# EAGLE design Pulsera (EAGLE 9.5.1)
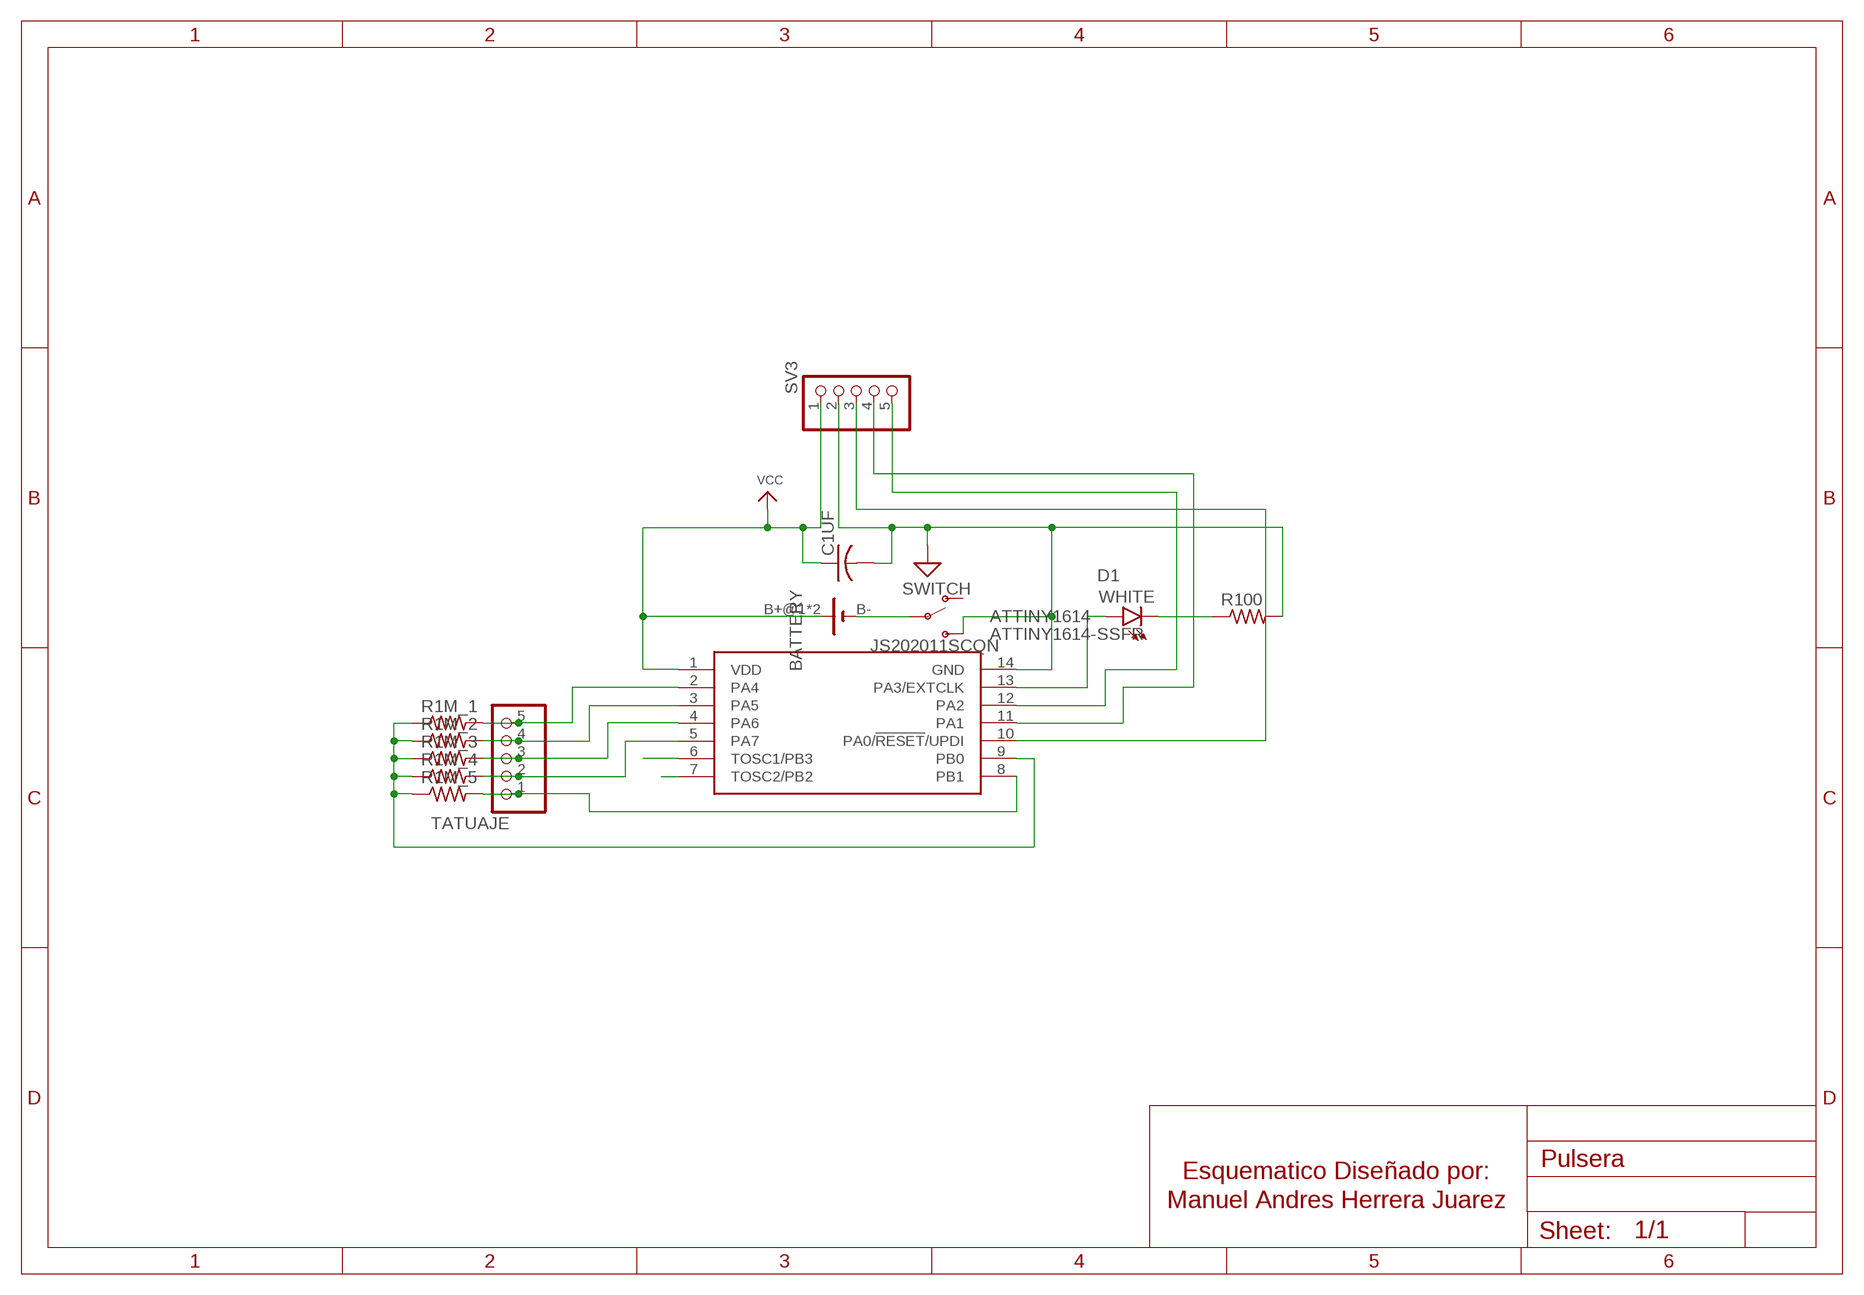
[diagram p0: schematic, sheet 1]

## Parts
ATTINY1614  ATTINY1614-SSFR  [SOIC127P600X175-14N]
BATTERY  BAT_HLD_CR12  [CR12-HOLDER]
C1UF  C-USC1206  [C1206]
D1  WHITE  LED-WHITE1206  [LED-1206]
R1M_1  R-US_R1206  [R1206]
R1M_2  R-US_R1206  [R1206]
R1M_3  R-US_R1206  [R1206]
R1M_4  R-US_R1206  [R1206]
R1M_5  R-US_R1206  [R1206]
R100  R-US_R1206  [R1206]
SV3  PINHD-1X5  [1X05]
SWITCH  JS202011SCQN  [JS202011SCQN]
TATUAJE  PINHD-1X5  [1X05]

## Nets
GND: ATTINY1614.14(GND) C1UF.2 R100.2 SV3.2 SWITCH.B2 SWITCH.L2 ; supply symbol labelled SUP
N$1: D1.C R100.1
N$2: ATTINY1614.6(TOSC1/PB3)
N$3: ATTINY1614.10(PA0/!RESET!/UPDI) SV3.3
N$4: ATTINY1614.9(PB0) R1M_1.1 R1M_2.1 R1M_3.1 R1M_4.1 R1M_5.1
N$5: ATTINY1614.11(PA1) SV3.4
N$6: ATTINY1614.7(TOSC2/PB2)
N$7: ATTINY1614.5(PA7) R1M_4.2 TATUAJE.2
N$8: ATTINY1614.8(PB1) R1M_5.2 TATUAJE.1
N$9: ATTINY1614.4(PA6) R1M_3.2 TATUAJE.3
N$10: ATTINY1614.3(PA5) R1M_2.2 TATUAJE.4
N$11: ATTINY1614.2(PA4) R1M_1.2 TATUAJE.5
N$12: ATTINY1614.12(PA2) SV3.5
N$13: ATTINY1614.13(PA3/EXTCLK) D1.A
N$14: BATTERY.B-(-) SWITCH.BC(C) SWITCH.LC(C)
VCC: ATTINY1614.1(VDD) BATTERY.B+@1(+) BATTERY.B+@2(+) C1UF.1 SV3.1
Unconnected: SWITCH.B1 SWITCH.L1

## Notes on the sheet
- Esquematico Diseñado por:
  Manuel Andres Herrera Juarez

## Library data of the parts
ATTINY1614 = SamacSys_Parts:ATTINY1614-SSFR: 8-bit Microcontrollers - MCU 20MHZ SOIC HIGH GRAD E 125C GRN Source: Datasheet <https://componentsearchengine.com/Datasheets/1/ATTINY1614-SSFR.pdf>; DESCRIPTION: 8-bit Microcontrollers - MCU 20MHZ SOIC HIGH GRAD E 125C GRN; HEIGHT: 1.75mm; MANUFACTURER_NAME: Microchip; MANUFACTURER_PART_NUMBER: ATTINY1614-SSFR; MOUSER_PART_NUMBER: 556-ATTINY1614SSFR; MOUSER_PRICE-STOCK: https://www.mouser.com/Search/Refine.aspx?Keyword=556-ATTINY1614SSFR
BATTERY = MyLibrary:BAT_HLD_CR12
C1UF = resistor:C-US: CAPACITOR, American symbol
D1 = SparkFun-LED:LED-WHITE: White SMD LED Used in manufacturing several products at SparkFun. Packages: 0603 - Bright White SMD 0603 package[Product Link] <http://www.kingbrightusa.com/product.asp?catalog_name=LED&product_id=APT1608QWF/D> 1206 - Bright White SMD1206 package [Product Link] <http://www.kingbrightusa.com/product.asp?catalog_name=LED&product_id=APT3216QWF/D> 3014 - Super Bright SMD 3014 package [Datasheet] <http://www.lumileds.com/uploads/459/DS208-pdf> SparkFun Products: Blackberry Trackballer Breakout <https://www.sparkfun.com/products/13169> Digital SandBox <https://www.sparkfun.com/products/12651>; PROD_ID: DIO-09955
R1M_1-R1M_5 R100 = resistor:R-US_: RESISTOR, American symbol
SV3 TATUAJE = pinhead:PINHD-1X5: PIN HEADER
SWITCH = MyLibrary:JS202011SCQN

## Board
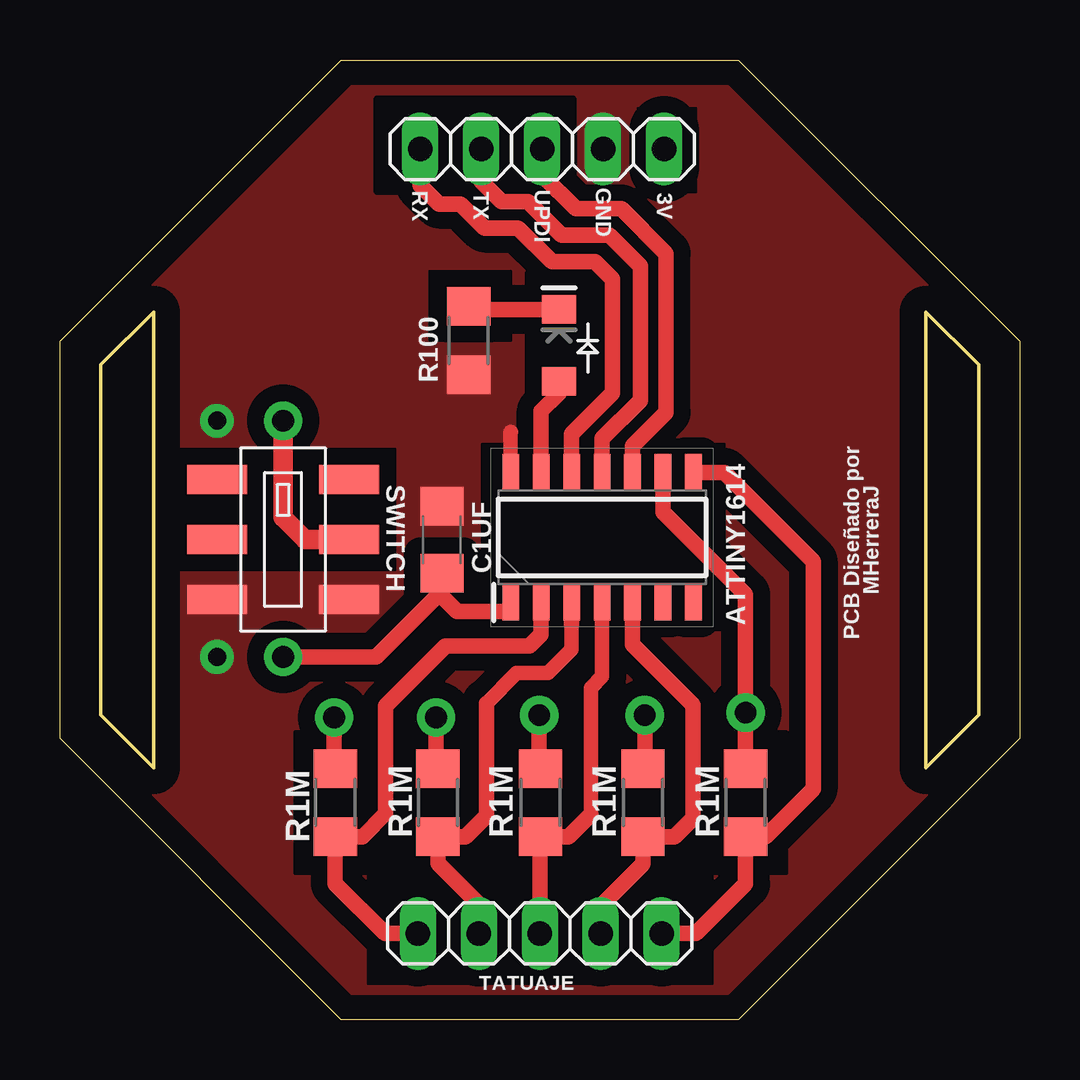
[diagram p1: board, top side]
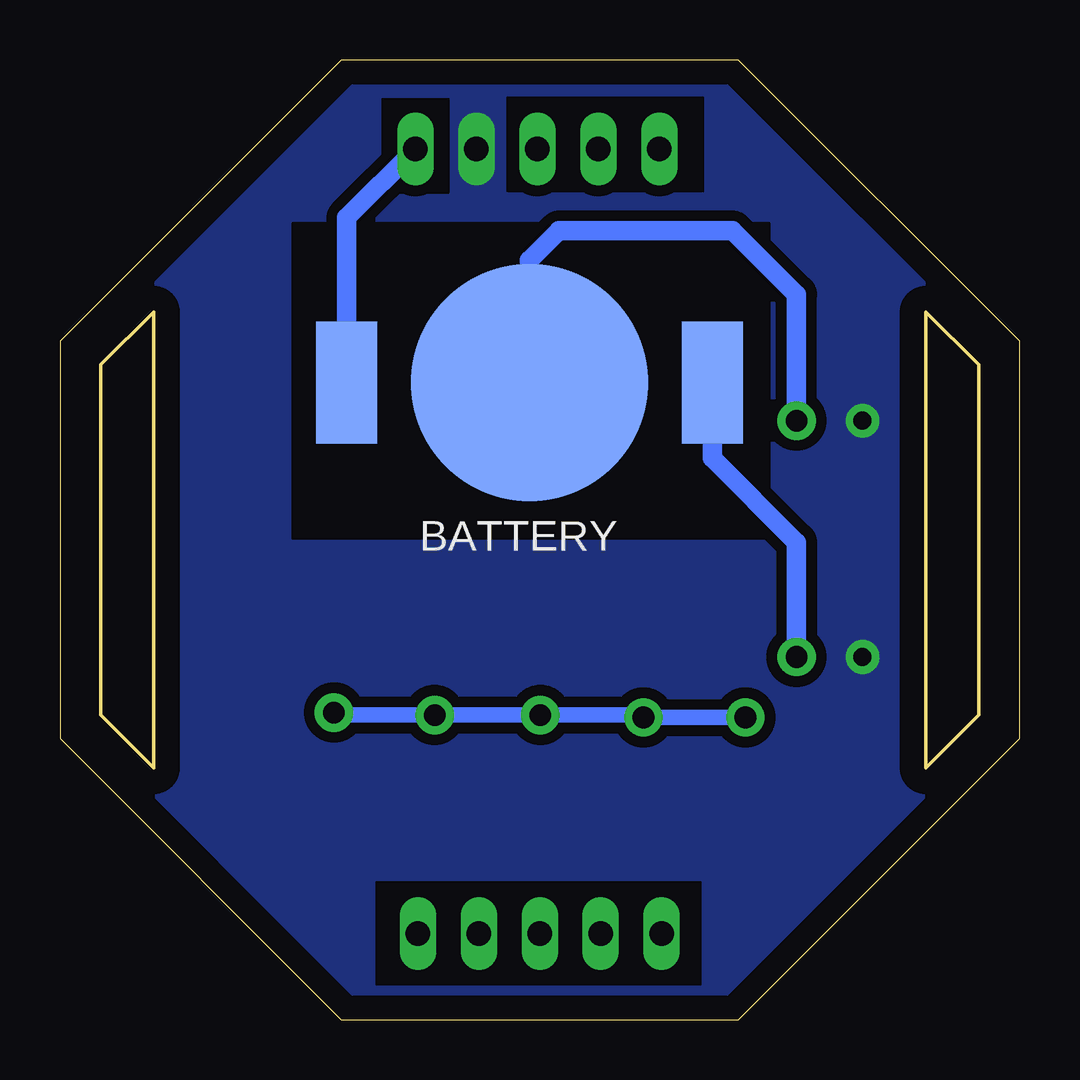
[diagram p2: board, bottom side, seen from below]

Size 40 x 40 mm. Coordinates in mm from the lower left corner, seen from the top.
Outline: 40,28.28 40,11.72 28.28,0 11.72,0 0,11.72 0,28.28 11.72,40 28.28,40 40,28.28
Copper layers (1*16): Top 0.035mm / dielectric 1.5mm / Bottom 0.035mm
Design rules "default": minimum track width 6mil, minimum drill 0.35mm, track to track 6mil, track to pad 6mil, pad to pad 6mil, via to via 6mil, smd to smd 6mil, copper to edge 40mil, drill to drill 6mil, minimum pad ring 10mil, minimum via ring 8mil, stop-mask expansion 4mil, vias tented up to drill 0mil, thermal gap 10mil

### Footprints (pad centres in the part's own frame; a part is rotated, then mirrored left to right if it is on the bottom)
SOIC127P600X175-14N = smd 1.525 x 0.7: 1 -2.712,3.81; 2 -2.712,2.54; 3 -2.712,1.27; 4 -2.712,0; 5 -2.712,-1.27; 6 -2.712,-2.54; 7 -2.712,-3.81; 8 2.712,-3.81; 9 2.712,-2.54; 10 2.712,-1.27; 11 2.712,0; 12 2.712,1.27; 13 2.712,2.54; 14 2.712,3.81
CR12-HOLDER = smd 2.54 x 5.08: B+@1 -7.62,0; B+@2 7.62,0 | smd 9.906 x 9.906: B- 0,0
C1206 = smd 1.6 x 1.8: 1 -1.4,0; 2 1.4,0
LED-1206 = smd 1.2 x 1.4: A -1.5,0; C 1.5,0
R1206 = smd 1.6 x 1.803: 1 -1.422,0; 2 1.422,0
1X05 = drill 1.016 long: 1 -5.08,0; 2 -2.54,0; 3 0,0; 4 2.54,0; 5 5.08,0
JS202011SCQN = smd 1.194 x 2.502: B1 -2.502,2.75; B2 2.502,2.75; BC 0,2.75; L1 -2.502,-2.75; L2 2.502,-2.75; LC 0,-2.75

### Placement (x,y rotation side)
ATTINY1614  22.6,20.1 90 top
BATTERY  20.43,26.55 180 bottom
C1UF  15.92,20 90 top
D1  20.8,28.1 90 top
R1M_1  11.48,9.04 270 top
R1M_2  15.75,9.04 270 top
R1M_3  20.03,9.04 270 top
R1M_4  24.3,9.04 270 top
R1M_5  28.58,9.04 270 top
R100  17.04,28.3 270 top
SV3  20.1,36.29 180 top
SWITCH  9.3,20.01 270 top
TATUAJE  20,3.59 180 top

### Tracks (layer width: path | path; a pad name or v marks a point on that pad's centre or on a via)
GND  (via drill 0.75 pad 1.4)
  Top 0.61: ATTINY1614.14 18.79,24.49 18.8,24.5
  other vias: 6.55,24.97 6.55,15.12
  pour Bottom (isolate 0.45, no thermals): 40,28.25 40,11.75 28.25,0 11.75,0 0,11.75 0,28.25 11.75,40 28.25,40
  pour Top (isolate 0.7, no thermals): 10.59,40 28.3,40 40,28.3 40,11.8 28.2,0 11.8,0 0,11.8 0,29.41
N$1
  Top 0.65: D1.C 17.16,29.6 R100.1
N$3
  Top 0.65: ATTINY1614.10 23.87,23.91 25.27,25.31 25.27,31.93 23.4,33.8 21.5,33.8 20.1,35.2 SV3.3
N$4  (via drill 0.9 pad 1.6)
  Top 0.65: R1M_5.1 v28.58,12.79 28.58,17.72 25.14,21.16 ATTINY1614.9 | v24.38,12.69 24.38,10.54 R1M_4.1 | R1M_3.1 19.98,10.52 v19.98,12.69 | R1M_2.1 15.68,10.54 v15.68,12.59 | v11.43,12.59 11.43,10.52 R1M_1.1
  Bottom 0.65: v28.58,12.79 28.48,12.69 v24.38,12.69 v19.98,12.69 15.78,12.69 v15.68,12.59 v11.43,12.59
N$5
  Top 0.65: ATTINY1614.11 22.6,24.21 24.2,25.81 24.2,31.4 22.9,32.7 20.9,32.7 19.5,34.1 18.4,34.1 17.56,34.94 SV3.4
N$7
  Top 0.65: ATTINY1614.5 23.87,15.63 26.38,13.12 26.38,8.39 25.61,7.62 R1M_4.2 24.3,6.48 22.54,4.72 TATUAJE.2
N$8
  Top 0.65: ATTINY1614.8 27.69,22.81 31.4,19.1 31.4,9.62 29.41,7.62 R1M_5.2 28.58,5.65 26.52,3.59 TATUAJE.1
N$9
  Top 0.61: ATTINY1614.4 22.6,14.3 22.13,13.83 22.13,8.54
  Top 0.65: 22.13,8.54 21.21,7.62 R1M_3.2 20,7.59 TATUAJE.3
N$10
  Top 0.61: 17.78,13.18 19.04,14.44 20.34,14.44 21.33,15.43 21.33,16.43
  Top 0.65: 21.33,16.43 ATTINY1614.3 | 17.78,13.18 17.78,8.49 16.91,7.62 R1M_2.2 15.75,6.51 17.46,4.81 TATUAJE.4
N$11
  Top 0.65: 11.48,7.2 R1M_1.2 | R1M_1.2 12.61,7.62 13.58,8.59 13.58,13.08 16.06,15.56 19.56,15.56 20.06,16.06 ATTINY1614.2 | R1M_1.2 11.48,5.67 13.55,3.59 TATUAJE.5
N$12
  Top 0.65: ATTINY1614.12 21.33,24.41 23.03,26.11 23.03,30.87 22.3,31.6 20.5,31.6 19.1,33 17.7,33 16.7,34 15.8,34 15.02,34.78 SV3.5
N$13
  Top 0.65: ATTINY1614.13 20.06,25.36 20.8,26.1 D1.A
N$14  (via drill 0.9 pad 1.6)
  Top 0.813: v9.3,24.97 9.3,20.92 10.21,20.01 SWITCH.BC
  Bottom 0.75: BATTERY.B- 18.84,24.97
  Bottom 0.813: v9.3,24.97 9.3,30.22 11.96,32.88 19.2,32.88 20.43,31.65 BATTERY.B-
NC
  cutout Top: 17.6,16.25 17.6,24 27.7,24 27.7,16.25
  cutout Bottom: 10.43,20.06 30.3,20.06 30.3,33.19 10.43,33.19
  cutout Top: 18.8,28.3 15.4,28.3 15.4,31.2 18.8,31.2
  cutout Bottom: 13.3,5.72 26.8,5.72 26.8,1.48 13.3,1.48
  cutout Bottom: 26.55,38.38 23.8,38.38 23.8,34.48 26.55,34.48
  cutout Bottom: 21.35,38.42 13.2,38.42 13.2,34.52 21.35,34.52
  cutout Top: 14.78,17.1 17.1,17.1 17.1,19.8 14.78,19.8
  cutout Top: 19.44,31.13 22.11,31.13 22.11,25.58 19.44,25.58
  cutout Top: 13.2,38.4 21.4,38.4 21.4,34.5 13.2,34.5
  cutout Top: 12.84,5.97 27.19,5.97 27.19,1.5 12.84,1.5
  cutout Top: 24.1,34.5 26.5,34.5 26.5,38 24.1,38
  cutout Top: 9.8,11.98 30.28,11.98 30.28,6.09 9.8,6.09
NC1
  cutout Top: 13.96,18.74 13.96,23.79 5.05,23.79 5.05,18.74
VCC  (via drill 0.9 pad 1.6)
  Top 0.65: ATTINY1614.1 18.79,17.09 18.7,17 16.55,17 15.92,17.63 C1UF.1 15.92,18.02 15.92,17.87 13.17,15.12 v9.3,15.12
  Bottom 0.65: BATTERY.B+@1 12.61,26.35
  Bottom 0.813: SV3.1 28.05,33.42 BATTERY.B+@2 | v9.3,15.12 9.3,19.89 12.8,23.4 BATTERY.B+@1

### Text on the board
tNames: RX | TX | UPDI | GND | 3V | SWITCH | PCB Diseñado por / MHerreraJ | R1M | R1M | R1M | R1M | R1M
200bmp: UNAM